# EAGLE schematic Parachute_V1.5(openloadsensor) (EAGLE 9.6.2)
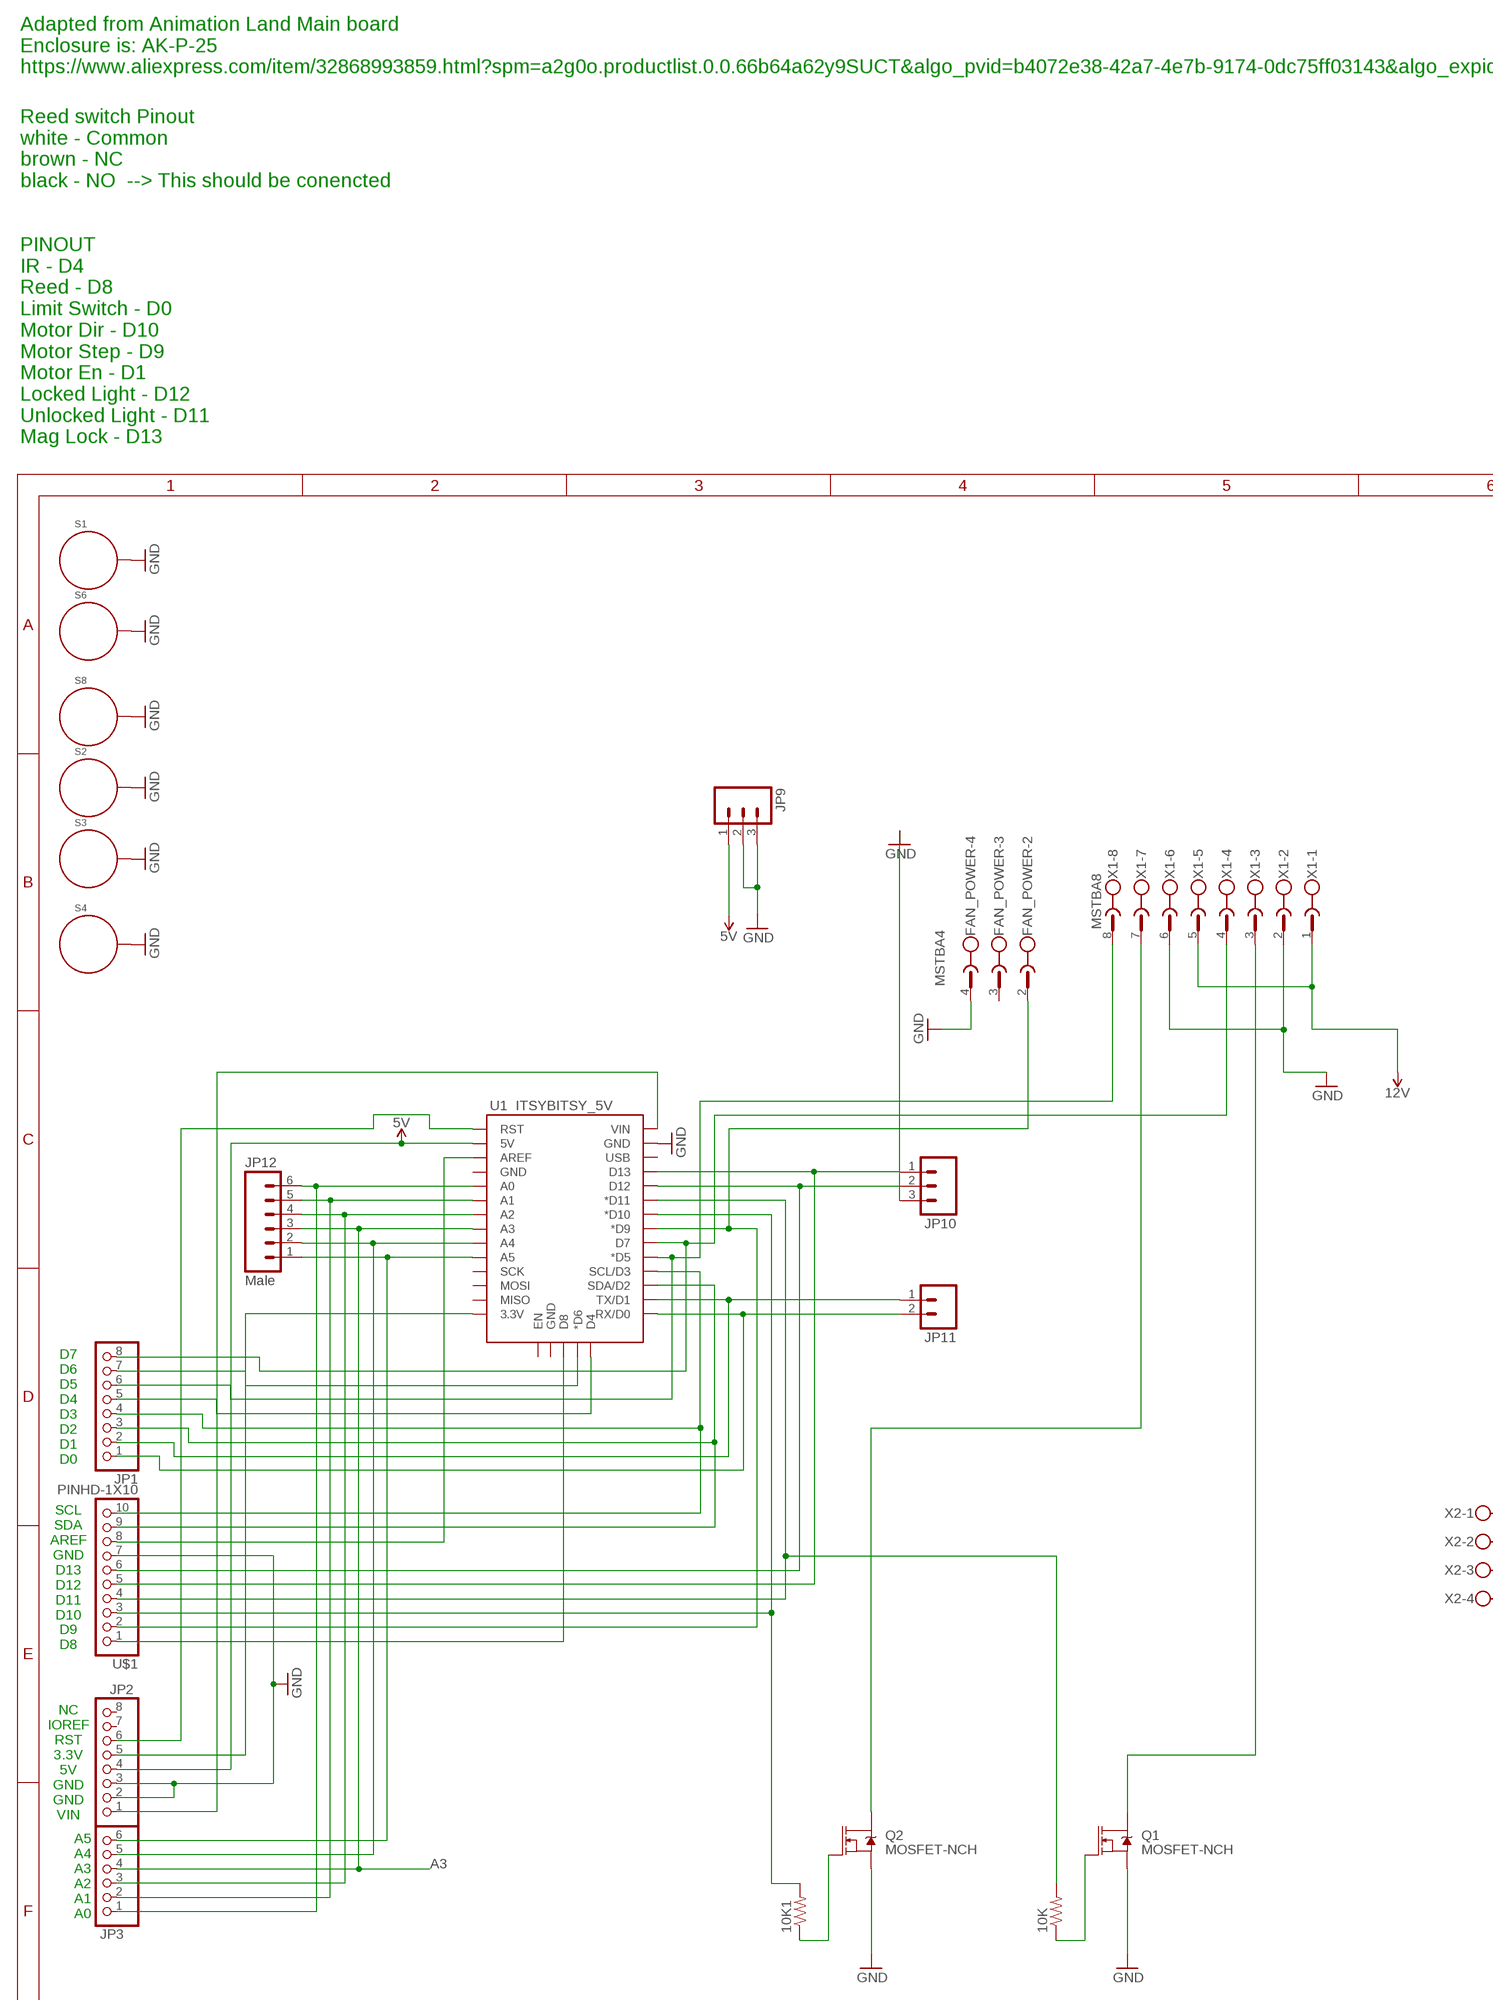
[diagram p0: schematic, sheet 1, part 1 of 2]
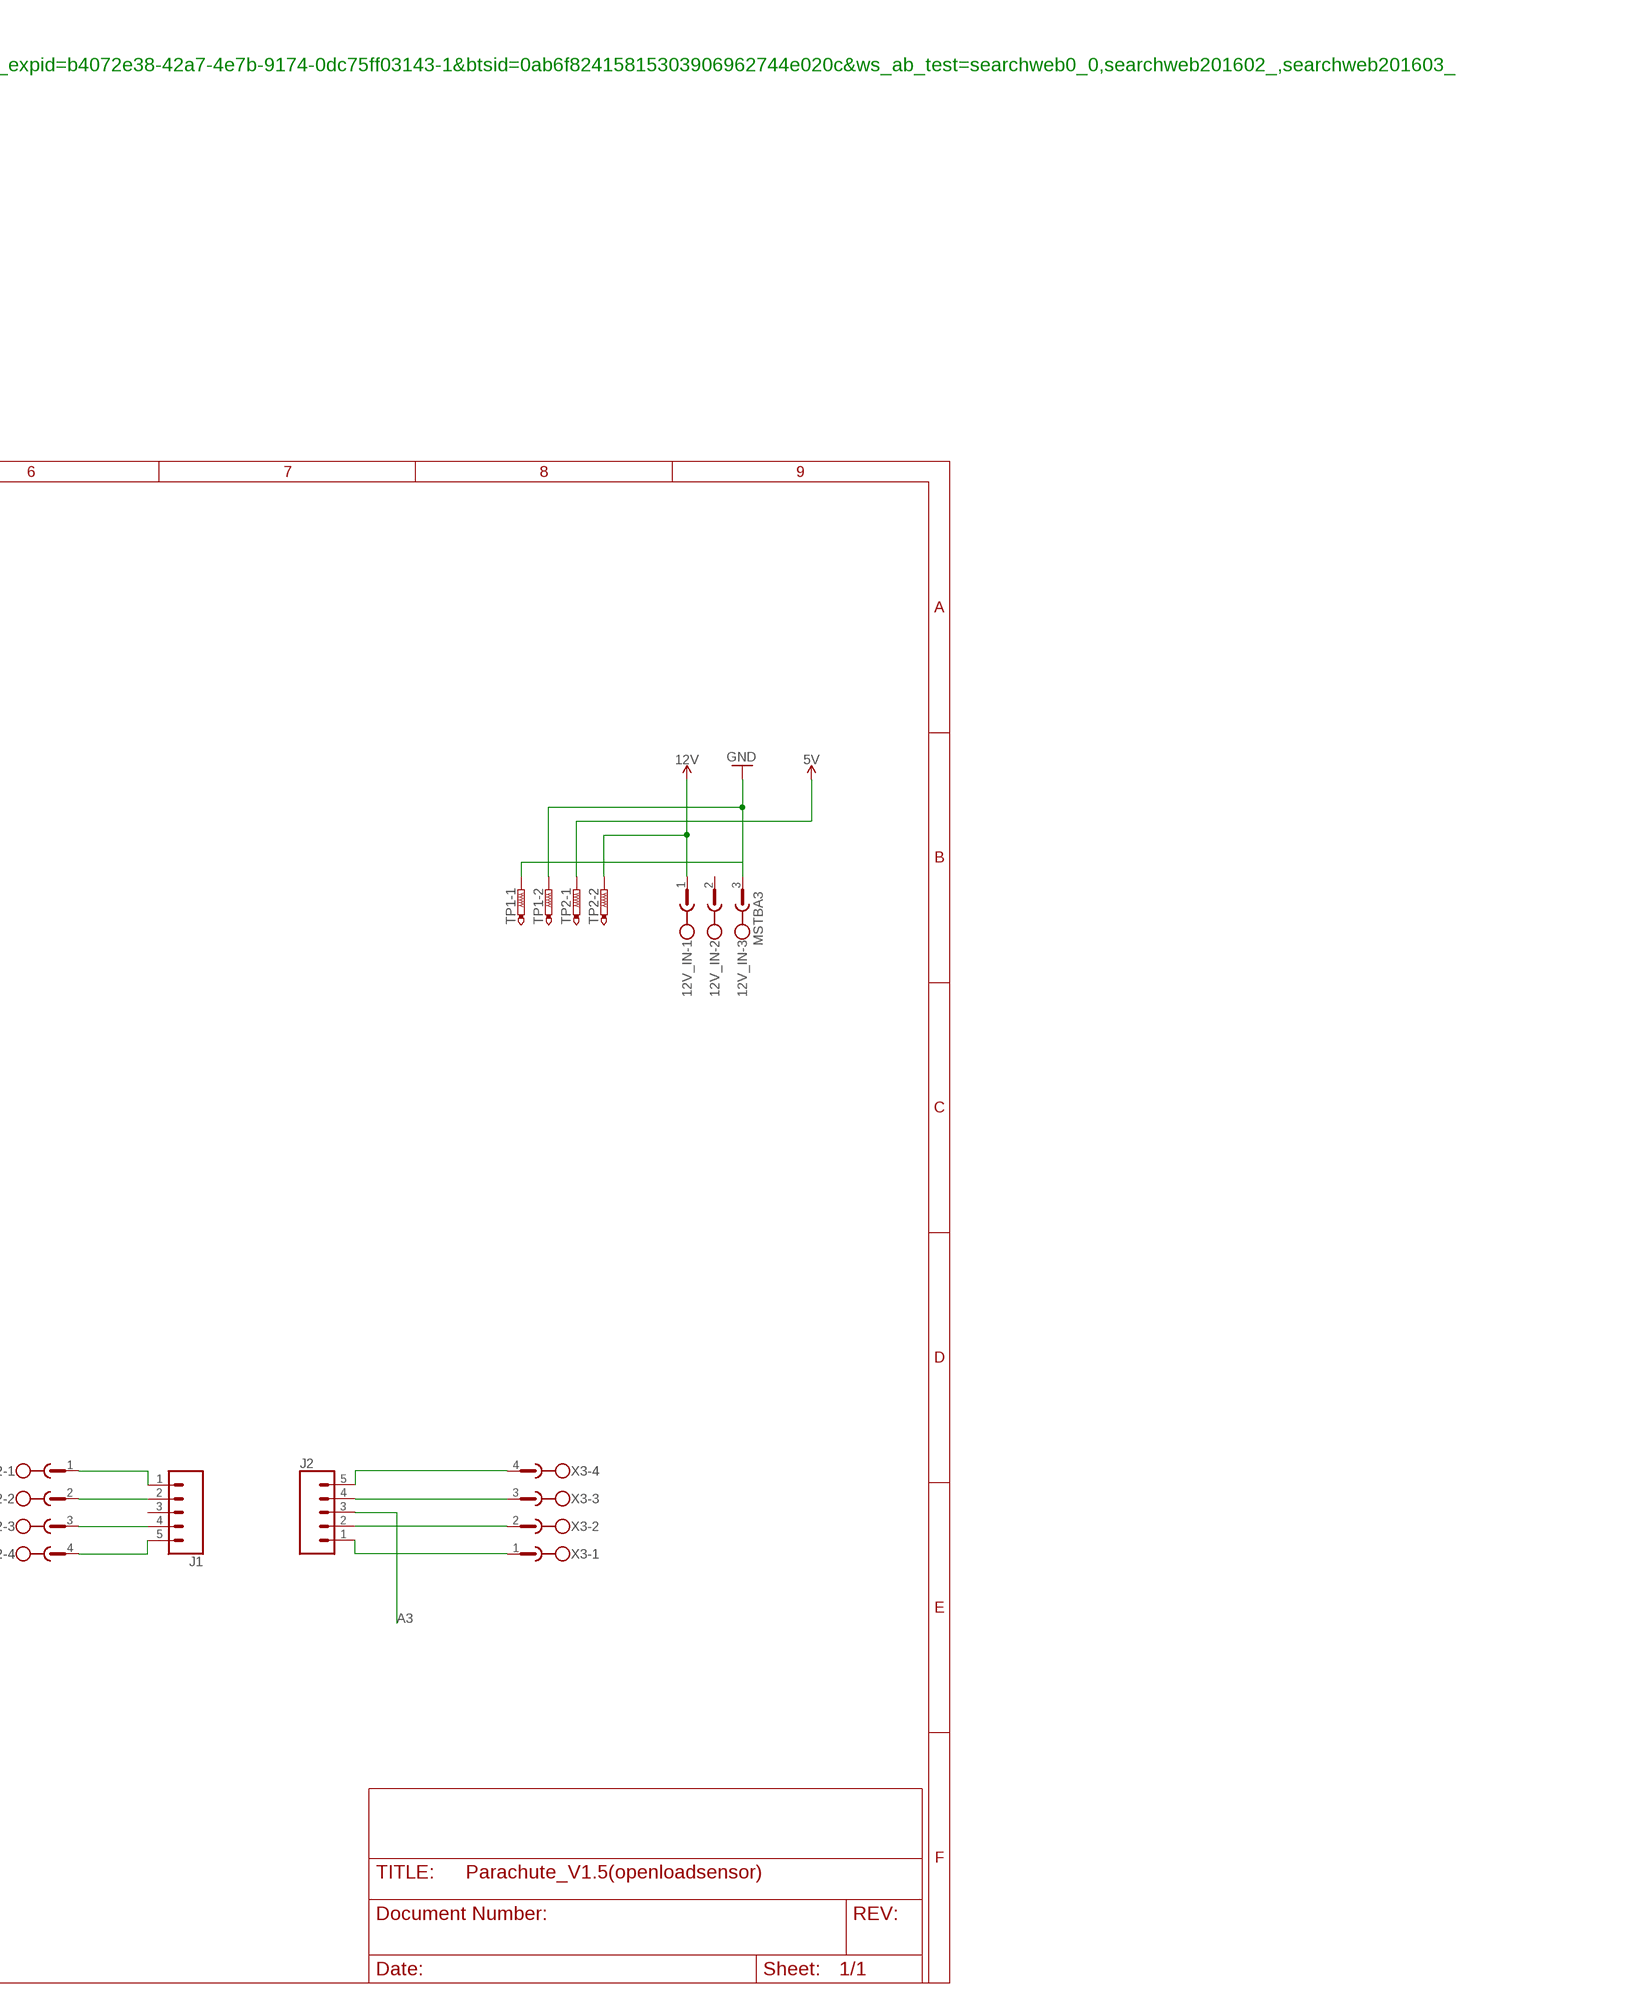
[diagram p1: schematic, sheet 1, part 2 of 2]

## Parts
10K  R-US_M0805  [M0805]
10K1  R-US_M0805  [M0805]
12V_IN  MSTBA3  [MSTBA3]
FAN_POWER  MSTBA4  [MSTBA4]
J1  JST_CONN_05  [HEADER_PIN_1X05]
J2  JST_CONN_05  [HEADER_PIN_1X05]
JP1  PINHD-1X8CLEANBIG  [1X08-CLEANBIG]
JP2  PINHD-1X8CLEANBIG  [1X08-CLEANBIG]
JP3  PINHD-1X6B  [1X06-BIG]
JP9  M031X03_NO_SILK  [1X03_NO_SILK]
JP10  M031X03_NO_SILK  [1X03_NO_SILK]
JP11  M021X02_NO_SILK  [1X02_NO_SILK]
JP12  Male  M06SIP  [1X06]
Q1  MOSFET-NCH  [SO-8_POWER_PAK]
Q2  MOSFET-NCH  [SO-8_POWER_PAK]
S1  STANDOFF_ELECTRICAL5-32  [STANDOFF_ELECTRICAL_5_32]
S2  STANDOFF_ELECTRICAL5-32  [STANDOFF_ELECTRICAL_5_32]
S3  STANDOFF_ELECTRICAL5-32  [STANDOFF_ELECTRICAL_5_32]
S4  STANDOFF_ELECTRICAL5-32  [STANDOFF_ELECTRICAL_5_32]
S6  STANDOFF_ELECTRICAL5-32  [STANDOFF_ELECTRICAL_5_32]
S8  STANDOFF_ELECTRICAL5-32  [STANDOFF_ELECTRICAL_5_32]
TP1  PTR2  [P2-38-17]
TP2  PTR2  [P2-38-17]
U1  ITSYBITSY_5V  [ADAFRUIT_LENOARDO]
U$1  PINHD-1X10  [1X10-BIG]
X1  MSTBA8  [MSTBA8]
X2  PHOENIX_508_4PIN  [PHOENIX_508_4PIN]
X3  PHOENIX_508_4PIN  [PHOENIX_508_4PIN]

## Nets
5V [High Power]: JP2.4 JP9.1 TP2.TP-1 U1.5V
12V [High Power]: 12V_IN.1 TP2.TP-2 X1.1 X1.5
A3: J2.3 JP3.4 JP12.3 U1.A3
GND [High Power]: 12V_IN.3 FAN_POWER.4 JP2.2 JP2.3 JP9.2 JP9.3 JP10.3 Q1.S Q2.S S1.P1 S2.P1 S3.P1 S4.P1 S6.P1 S8.P1 TP1.TP-1 TP1.TP-2 U1.GND@2(GND) U$1.7 X1.2 X1.6
N$1: Q2.D1(D) X1.7
N$2: Q1.D1(D) X1.3
N$3: JP1.1 JP11.2 U1.RX(RX/D0)
N$4: U1.D8 U$1.1
N$5: JP1.2 JP11.1 U1.TX(TX/D1)
N$6: U1.AREF U$1.8
N$7: 10K.1 Q1.G
N$8: JP3.1 JP12.6 U1.A0
N$9: 10K1.1 Q2.G
N$10: JP3.2 JP12.5 U1.A1
N$11: JP3.3 JP12.4 U1.A2
N$13: JP3.5 JP12.2 U1.A4
N$14: JP3.6 JP12.1 U1.A5
N$15: JP10.2 U1.D12 U$1.6
N$16: JP1.3 U1.SDA(SDA/D2) U$1.9
N$17: JP1.4 U1.SCL(SCL/D3) U$1.10
N$18: JP10.1 U1.D13 U$1.5
N$19: JP1.6 U1.D5(*D5) X1.8
N$20: JP1.7 U1.D6(*D6)
N$21: JP1.8 U1.D7 X1.4
N$22: JP1.5 U1.D4
N$23: JP2.6 U1.RES(RST)
N$24: J1.1 X2.1
N$25: JP2.5 U1.3V(3.3V)
N$26: J1.5 X2.4
N$27: FAN_POWER.2 U1.D9(*D9) U$1.2
N$28: 10K1.2 U1.D10(*D10) U$1.3
N$29: 10K.2 U1.D11(*D11) U$1.4
N$30: J1.4 X2.3
N$31: JP2.1 U1.VIN
N$32: J1.2 X2.2
N$33: J2.5 X3.4
N$34: J2.4 X3.3
N$35: J2.1 X3.1
N$36: J2.2 X3.2
Unconnected: 12V_IN.2 FAN_POWER.1 FAN_POWER.3 J1.3 JP2.7 JP2.8 U1.EN U1.GND@0(GND) U1.GND@1(GND) U1.MISO U1.MOSI U1.SCK U1.USB

## Notes on the sheet
- Adapted from Animation Land Main board
  Enclosure is: AK-P-25
  https://www.aliexpress.com/item/32868993859.html?spm=a2g0o.productlist.0.0.66b64a62y9SUCT&algo_pvid=b4072e38-42a7-4e7b-9174-0dc75ff03143&algo_expid=b4072e38-42a7-4e7b-9174-0dc75ff03143-1&btsid=0ab6f82415815303906962744e020c&ws_ab_test=searchweb0_0,searchweb201602_,searchweb201603_
- Reed switch Pinout
  white - Common
  brown - NC
  black - NO  --> This should be conencted
  
  
  PINOUT
  IR - D4
  Reed - D8
  Limit Switch - D0
  Motor Dir - D10
  Motor Step - D9
  Motor En - D1
  Locked Light - D12
  Unlocked Light - D11
  Mag Lock - D13
- D7
  D6
  D5
  D4
  D3
  D2
  D1
  D0
- SCL
  SDA
  AREF
  GND
  D13
  D12
  D11
  D10
  D9
  D8
- NC
  IOREF
  RST
  3.3V
  5V
  GND
  GND
  VIN
- A5
  A4
  A3
  A2
  A1
  A0

## Library data of the parts
10K 10K1 = adafruit:R-US_: RESISTOR, American symbol
12V_IN = con-phoenix-508:MSTBA3: PHOENIX; MF: FARNELL; MPN: 1757255; OC_FARNELL: 3705183; OC_NEWARK: 71C4162
FAN_POWER = th_libraries:MSTBA4: PHOENIX; MF: FARNELL; MPN: 1757268; OC_FARNELL: 3705195; OC_NEWARK: 71C4163
J1 J2 = OMSI_Default_V1:JST_CONN_05: Multi connection point. Often used as Generic Header-pin footprint for 0.1 inch spaced/style header connections On any of the 0.1 inch spaced packages, you can populate with these: Break Away Headers - Straight <https://www.sparkfun.com/products/116> (PRT-00116) Break Away Male Headers - Right Angle <https://www.sparkfun.com/products/553> (PRT-00553) Female Headers <https://www.sparkfun.com/products/115> (PRT-00115) Break Away Headers - Machine Pin <https://www.sparkfun.com/products/117> (PRT-00117) Break Away Female Headers - Swiss Machine Pin <https://www.sparkfun.com/products/743> (PRT-00743) For SCREWTERMINALS and SPRING TERMINALS visit here: Screw Terimnals on SparkFun.com <https://www.sparkfun.com/search/results?term=Screw+Terminals> (5mm/3.5mm/2.54mm spacing) This device is also useful as a general connection point to wire up your design to another part of your project. Our various solder wires solder well into these plated through hole pads. Hook-Up Wire - Assortment (Stranded, 22 AWG) <https://www.sparkfun.com/products/11375> (PRT-11375) Hook-Up Wire - Assortment (Solid Core, 22 AWG) <https://www.sparkfun.com/products/11367> (PRT-11367) View the entire wire category on our website here <https://www.sparkfun.com/categories/141> Special notes: Molex polarized connector foot print use with SKU : PRT-08231 with associated crimp pins and housings. 1MM SMD Version SKU: PRT-10208
JP1 JP2 = adafruit:PINHD-1X8: PIN HEADER
JP3 = adafruit:PINHD-1X6: PIN HEADER
JP9 JP10 = SparkFun-Connectors:M03: Header 3 Standard 3-pin 0.1" header. Use with straight break away headers (SKU : PRT-00116), right angle break away headers (PRT-00553), swiss pins (PRT-00743), machine pins (PRT-00117), and female headers (PRT-00115). Molex polarized connector foot print use with SKU : PRT-08232 with associated crimp pins and housings.
JP11 = SparkFun-Connectors:M02: Standard 2-pin 0.1" header. Use with - straight break away headers ( PRT-00116) - right angle break away headers (PRT-00553) - swiss pins (PRT-00743) - machine pins (PRT-00117) - female headers (PRT-00115) Molex polarized connector foot print use with: PRT-08233 with associated crimp pins and housings. 2.54_SCREWTERM for use with PRT-10571. 3.5mm Screw Terminal footprints for PRT-08084 5mm Screw Terminal footprints for use with PRT-08433
JP12 = SparkFun-Connectors:M06: Header 6 Standard 6-pin 0.1" header. Use with straight break away headers (SKU : PRT-00116), right angle break away headers (PRT-00553), swiss pins (PRT-00743), machine pins (PRT-00117), and female headers (PRT-00115). Molex polarized connector foot print use with SKU : PRT-08094 with associated crimp pins and housings. NOTES ON THE VARIANTS LOCK and LOCK_LONGPADS... This footprint was designed to help hold the alignment of a through-hole component (i.e. 6-pin header) while soldering it into place. You may notice that each hole has been shifted either up or down by 0.005 of an inch from it's more standard position (which is a perfectly straight line). This slight alteration caused the pins (the squares in the middle) to touch the edges of the holes. Because they are alternating, it causes a "brace" to hold the component in place. 0.005 has proven to be the perfect amount of "off-center" position when using our standard breakaway headers. Although looks a little odd when you look at the bare footprint, once you have a header in there, the alteration is very hard to notice. Also,if you push a header all the way into place, it is covered up entirely on the bottom side. This idea of altering the position of holes to aid alignment will be further integrated into the Sparkfun Library for other footprints. It can help hold any component with 3 or more connection pins.
Q1 Q2 = th_ds_libraries:MOSFET-NCH: N-channel MOSFETs from Sparkfun-DiscreteSemi Library
S1-S4 S6 S8 = th_libraries:STANDOFF_ELECTRICAL: A standoff intended to be an electrically connected point. Pad size and stop size allow for a #8 Phillips pan screw head to make a solid connection to the board. Added 144mill drill hole that fits my normal wood screw
TP1 TP2 = testpad:PTR2: TEST PIN
U1 = th_ds_libraries:ITSYBITSY_5V: Adafruit ItsyBitsy 32u4 - 5V 16MHz https://www.adafruit.com/product/3677
U$1 = adafruit:PINHD-1X10: Pin header 1x10 0.1" spacing With round pins
X1 = con-phoenix-508:MSTBA8: PHOENIX; MF: FARNELL; MPN: 1757307; OC_FARNELL: 3705225; OC_NEWARK: 71C4166
X2 X3 = OMSI_Default_V1:PHOENIX_508_4PIN: PHOENIX; MF: FARNELL; MPN: 1757268; OC_FARNELL: 3705195; OC_NEWARK: 71C4163

## Net classes
1 High Power: width 0.406 mm, drill 0.483 mm